# EAGLE schematic slambot (EAGLE 6.5.0)
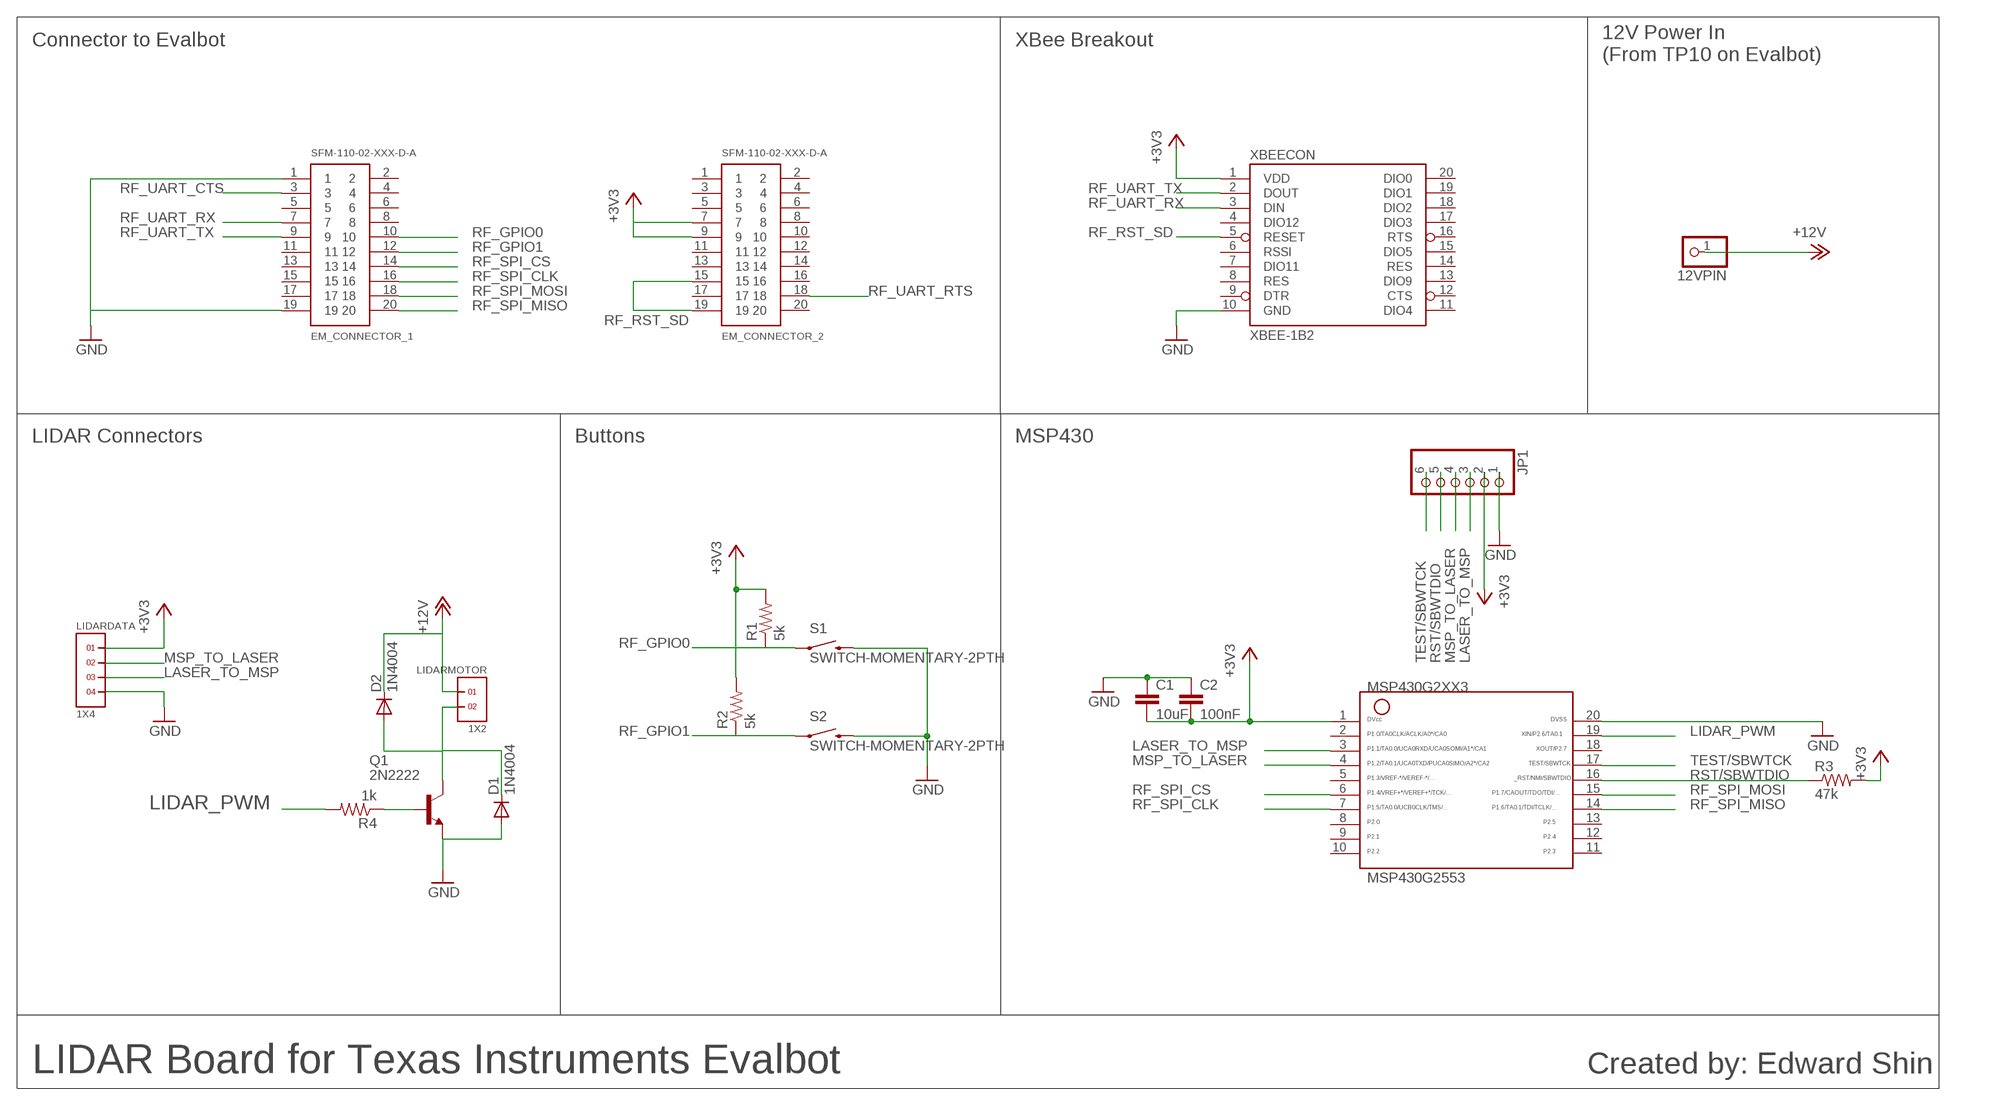
[diagram p0: schematic, sheet 1]

## Parts
12VPIN  PINHD-1X1  [1X01]
C1  10uF  C2.5/2  [C2.5-2]
C2  100nF  C2.5/2  [C2.5-2]
D1  1N4004  [DO41-10]
D2  1N4004  [DO41-10]
EM_CONNECTOR_1  SFM-110-02-XXX-D-A  [SFM-110-02-XXX-D-A]
EM_CONNECTOR_2  SFM-110-02-XXX-D-A  [SFM-110-02-XXX-D-A]
JP1  PINHD-1X6  [1X06]
LIDARDATA  1X4  [1X4]
LIDARMOTOR  1X2  [1X2]
MSP430G2553  G2XX3---N20  [N20]
Q1  2N2222  [TO18]
R1  5k  R-US_0309/12  [0309/12]
R2  5k  R-US_0309/12  [0309/12]
R3  47k  R-US_0309/12  [0309/12]
R4  1k  R-US_0309/12  [0309/12]
S1  SWITCH-MOMENTARY-2PTH  [TACTILE-PTH]
S2  SWITCH-MOMENTARY-2PTH  [TACTILE-PTH]
XBEECON  XBEE-1B2  [XBEE-SILK]

## Nets
+3V3: C1.2 C2.2 EM_CONNECTOR_2.7 EM_CONNECTOR_2.9 JP1.2 LIDARDATA.1 MSP430G2553.1 R1.2 R2.2 R3.2 XBEECON.1(VDD)
+12V: 12VPIN.1 D2.C LIDARMOTOR.1
GND: C1.1 C2.1 D1.A EM_CONNECTOR_1.1 EM_CONNECTOR_1.19 JP1.1 LIDARDATA.4 MSP430G2553.20 Q1.1(E) S1.3 S2.3 XBEECON.10(GND)
LASER_TO_MSP: JP1.3 LIDARDATA.3 MSP430G2553.3
LIDAR_PWM: MSP430G2553.19 R4.2
MSP_TO_LASER: JP1.4 LIDARDATA.2 MSP430G2553.4
N$1: Q1.2(B) R4.1
N$2: D1.C D2.A LIDARMOTOR.2 Q1.3(C)
RF_GPIO0: EM_CONNECTOR_1.10 R1.1 S1.1
RF_GPIO1: EM_CONNECTOR_1.12 R2.1 S2.1
RF_RST_SD: EM_CONNECTOR_2.15 EM_CONNECTOR_2.19 XBEECON.5(RESET)
RF_SPI_CLK: EM_CONNECTOR_1.16 MSP430G2553.7
RF_SPI_CS: EM_CONNECTOR_1.14 MSP430G2553.6
RF_SPI_MISO: EM_CONNECTOR_1.20 MSP430G2553.14
RF_SPI_MOSI: EM_CONNECTOR_1.18 MSP430G2553.15
RF_UART_CTS: EM_CONNECTOR_1.3
RF_UART_RTS: EM_CONNECTOR_2.18
RF_UART_RX: EM_CONNECTOR_1.7 XBEECON.3(DIN)
RF_UART_TX: EM_CONNECTOR_1.9 XBEECON.2(DOUT)
RST/SBWTDIO: JP1.5 MSP430G2553.16 R3.1
TEST/SBWTCK: JP1.6 MSP430G2553.17
Unconnected: EM_CONNECTOR_1.2 EM_CONNECTOR_1.4 EM_CONNECTOR_1.5 EM_CONNECTOR_1.6 EM_CONNECTOR_1.8 EM_CONNECTOR_1.11 EM_CONNECTOR_1.13 EM_CONNECTOR_1.15 EM_CONNECTOR_1.17 EM_CONNECTOR_2.1 EM_CONNECTOR_2.2 EM_CONNECTOR_2.3 EM_CONNECTOR_2.4 EM_CONNECTOR_2.5 EM_CONNECTOR_2.6 EM_CONNECTOR_2.8 EM_CONNECTOR_2.10 EM_CONNECTOR_2.11 EM_CONNECTOR_2.12 EM_CONNECTOR_2.13 EM_CONNECTOR_2.14 EM_CONNECTOR_2.16 EM_CONNECTOR_2.17 EM_CONNECTOR_2.20 MSP430G2553.2 MSP430G2553.5 MSP430G2553.8 MSP430G2553.9 MSP430G2553.10 MSP430G2553.11 MSP430G2553.12 MSP430G2553.13 MSP430G2553.18 XBEECON.4(DIO12) XBEECON.6(RSSI) XBEECON.7(DIO11) XBEECON.8(RES) XBEECON.9(DTR) XBEECON.11(DIO4) XBEECON.12(CTS) XBEECON.13(DIO9) XBEECON.14(RES) XBEECON.15(DIO5) XBEECON.16(RTS) XBEECON.17(DIO3) XBEECON.18(DIO2) XBEECON.19(DIO1) XBEECON.20(DIO0)

## Notes on the sheet
- Connector to Evalbot | XBee Breakout
- 12V Power In
  (From TP10 on Evalbot)
- LIDAR Connectors | Buttons | MSP430
- LIDAR Board for Texas Instruments Evalbot | Created by: Edward Shin

## Library data of the parts
12VPIN = pinhead:PINHD-1X1: PIN HEADER
C1 C2 = capacitor-wima:C: CAPACITOR naming: grid - package width
D1 D2 = diode:1N4004: DIODE general purpose rectifier, 1 A
EM_CONNECTOR_1 EM_CONNECTOR_2 = SFM-110-02-XXX-D-A:SFM-110-02-XXX-D-A: 0.05"X0.05" SOCKET STRIP DOUBLE ROW ASSEMBLY. MANUFACTURER: SAMTEC.
JP1 = pinhead:PINHD-1X6: PIN HEADER
LIDARDATA = headers(2mm):1X4
LIDARMOTOR = headers(2mm):1X2
MSP430G2553 = TI_MSP430_v16:G2XX3---N20: MSP430G2XX1 PDIP (N) 20 Pin Package
Q1 = transistor-npn:2N2222*: NPN Transistor
R1-R4 = resistor:R-US_: RESISTOR, American symbol
S1 S2 = SparkFun-Electromechanical:SWITCH-MOMENTARY-2: Various NO switches- pushbuttons, reed, etc
XBEECON = SparkFun-RF:XBEE-1: Xbee module footprints SMT header is CONN-09042.